# EAGLE design shcV1 (EAGLE 7.1.0)
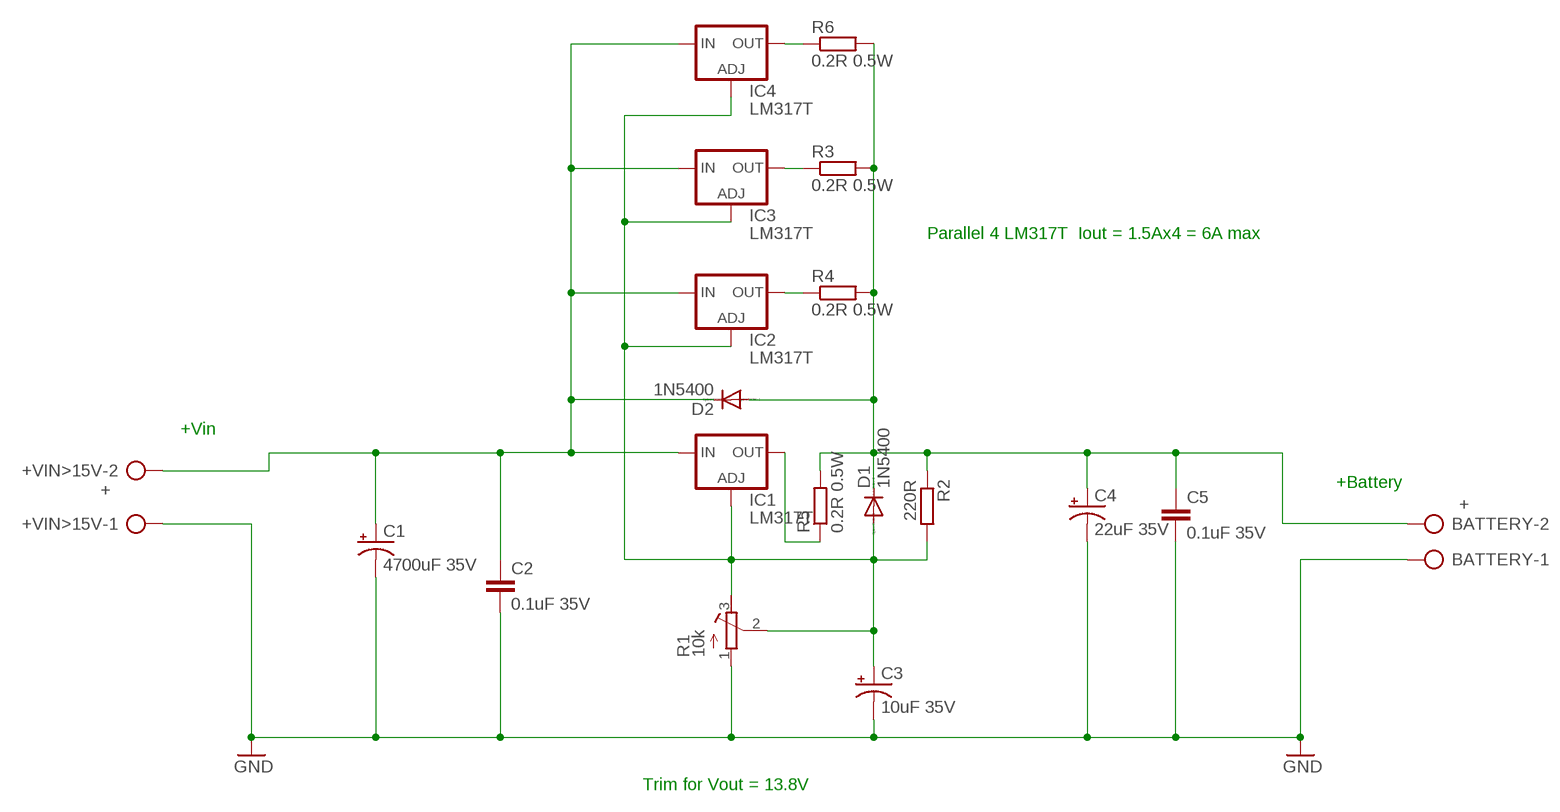
[diagram p0: schematic, sheet 1]

## Parts
+VIN>15V  +  AK300/2  [AK300/2]
BATTERY  +  AK300/2  [AK300/2]
C1  4700uF 35V  CPOL-USE5-13  [E5-13]
C2  0.1uF 35V  C-EU050-024X044  [C050-024X044]
C3  10uF 35V  CPOL-USE5-13  [E5-13]
C4  22uF 35V  CPOL-USE5-13  [E5-13]
C5  0.1uF 35V  C-EU050-024X044  [C050-024X044]
D1  1N5400  [DO201-15]
D2  1N5400  [DO201-15]
IC1  LM317T  LM317TS  [317TS]
IC2  LM317T  LM317TS  [317TS]
IC3  LM317T  LM317TS  [317TS]
IC4  LM317T  LM317TS  [317TS]
R1  10k  R-TRIMM64W  [RTRIM64W]
R2  220R  R-EU_0207/10  [0207/10]
R3  0.2R 0.5W  R-EU_0207/10  [0207/10]
R4  0.2R 0.5W  R-EU_0207/10  [0207/10]
R5  0.2R 0.5W  R-EU_0207/10  [0207/10]
R6  0.2R 0.5W  R-EU_0207/10  [0207/10]

## Nets
+BATTERY12V: BATTERY.2 C4.+ C5.1 D1.C D2.A R2.1 R3.2 R4.2 R5.2 R6.2
+FROM_MPPT: +VIN>15V.2 C1.+ C2.1 D2.C IC1.3(IN) IC2.3(IN) IC3.3(IN) IC4.3(IN)
GND: +VIN>15V.1 BATTERY.1 C1.- C2.2 C3.- C4.- C5.2 R1.1(A)
N$1: IC4.2(OUT) R6.1
N$3: C3.+ D1.A IC1.1(ADJ) IC2.1(ADJ) IC3.1(ADJ) IC4.1(ADJ) R1.2(S) R1.3(E) R2.2
N$5: IC1.2(OUT) R5.1
N$7: IC3.2(OUT) R3.1
N$8: IC2.2(OUT) R4.1

## Notes on the sheet
- Parallel 4 LM317T  Iout = 1.5Ax4 = 6A max
- +Vin
- +Battery
- Trim for Vout = 13.8V

## Library data of the parts
+VIN>15V BATTERY = con-ptr500:AK300/2: CONNECTOR; OC_FARNELL: unknown; OC_NEWARK: unknown
C1 C3 C4 = rcl:CPOL-US: POLARIZED CAPACITOR, American symbol
C2 C5 = rcl:C-EU: CAPACITOR, European symbol
D1 D2 = diode:1N5400: DIODE standard rectifier, 3 A, 50 V (Motorola)
IC1-IC4 = v-reg:LM317TS: VOLTAGE REGULATOR
R1 = rcl:R-TRIMM: Trimm resistor
R2-R6 = rcl:R-EU_: RESISTOR, European symbol

## Board
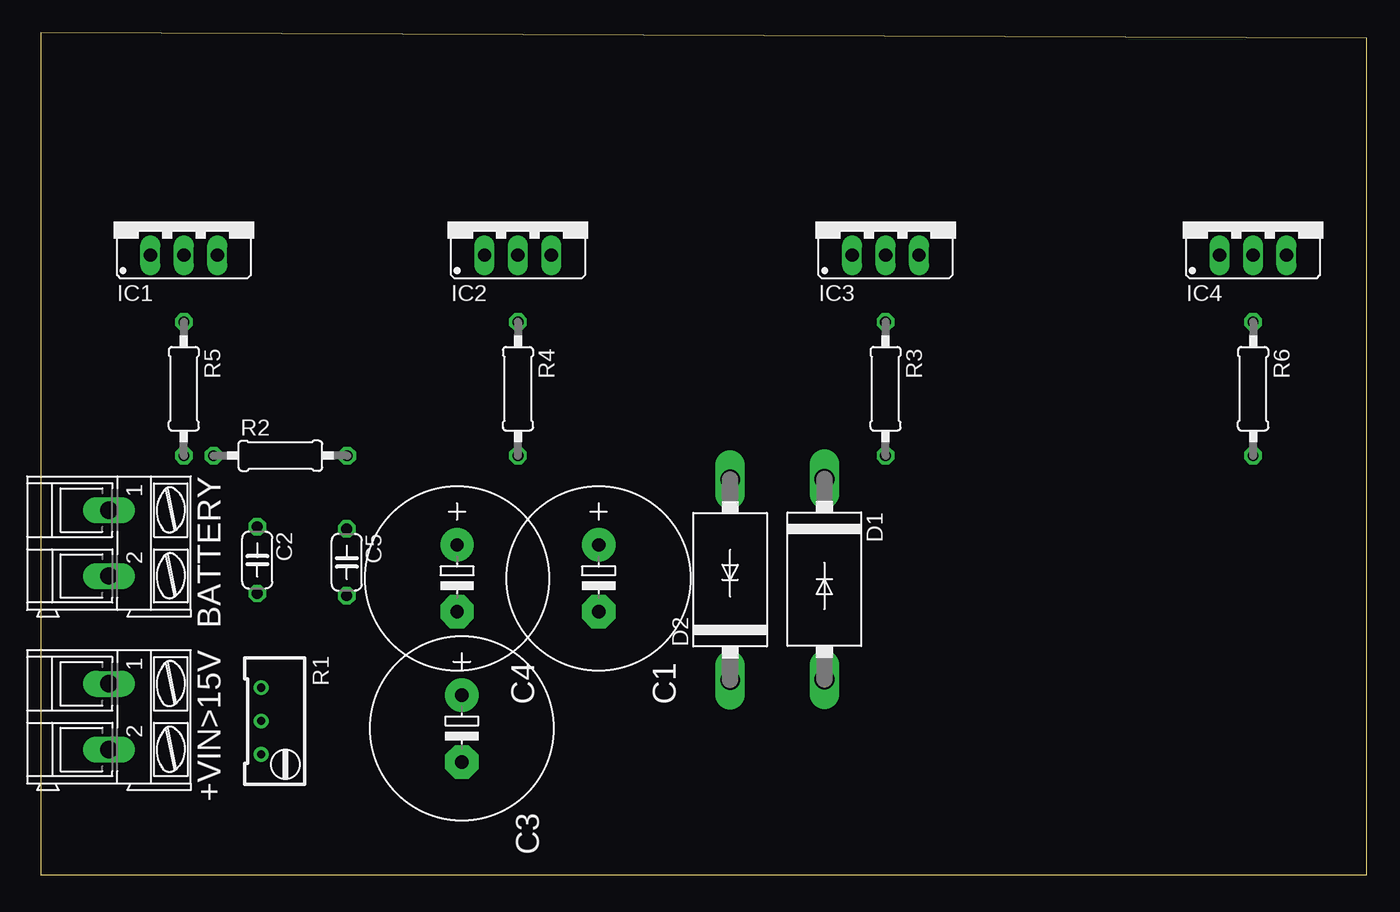
[diagram p1: board, top side]
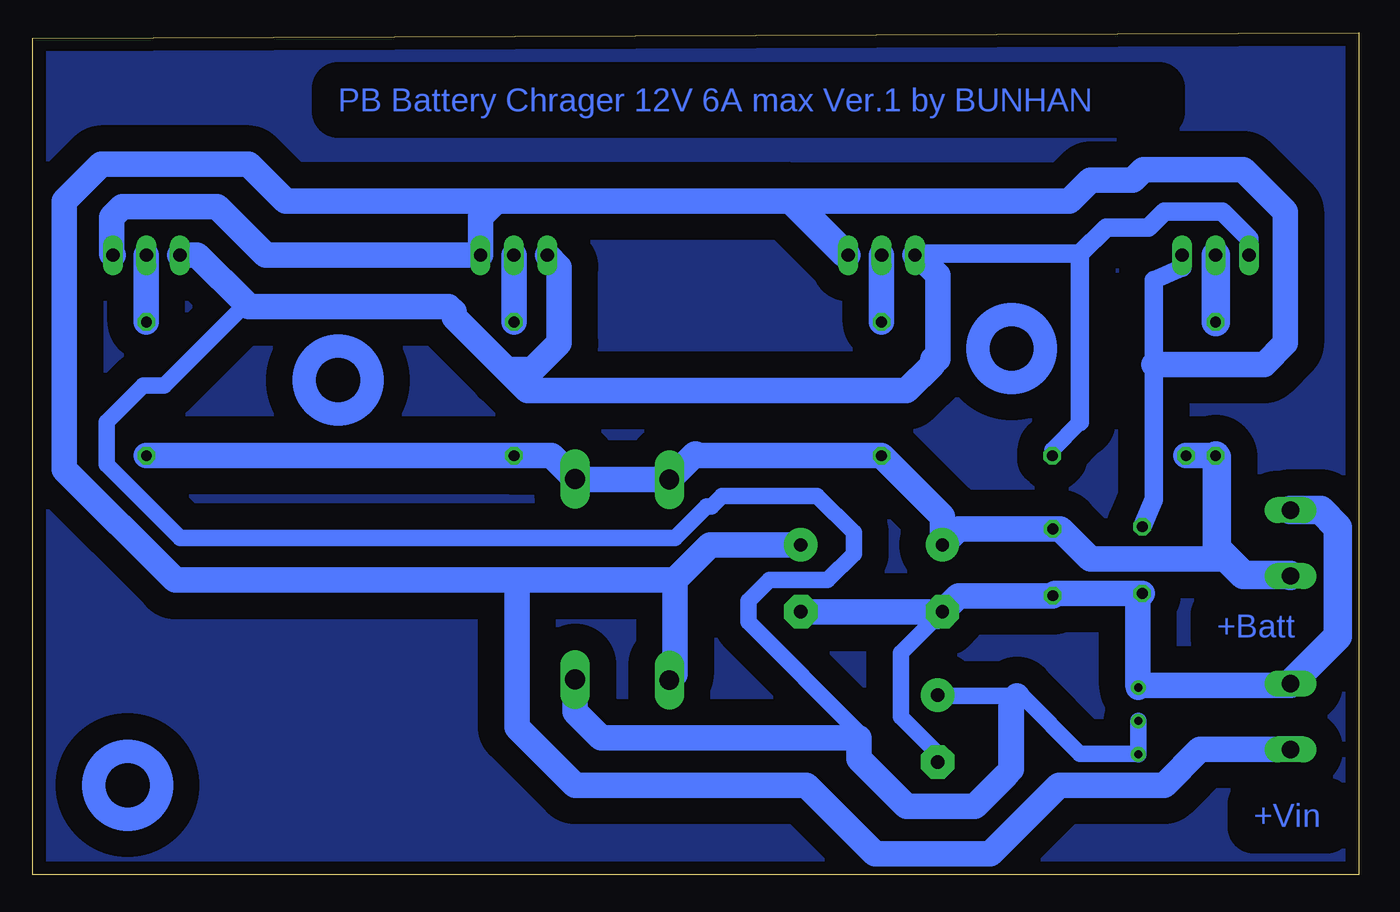
[diagram p2: board, bottom side, seen from below]

Size 100.8 x 64 mm. Coordinates in mm from the lower left corner, seen from the top.
Outline: 0,0 100.8,0 100.8,63.6 0,64 0,0
Copper layers (1*16): Top 0.035mm / dielectric 1.5mm / Bottom 0.035mm
Design rules "default *": minimum track width 10mil, minimum drill 24mil, track to track 2mm, track to pad 8mil, pad to pad 8mil, via to via 8mil, smd to smd 8mil, copper to edge 40mil, drill to drill 8mil, minimum pad ring 10mil, minimum via ring 8mil, stop-mask expansion 4mil, vias tented up to drill 0mil, thermal gap 10mil

### Footprints (pad centres in the part's own frame; a part is rotated, then mirrored left to right if it is on the bottom)
AK300/2 = drill 1.321 long: 1 -2.515,0; 2 2.489,0
E5-13 = drill 1.016 pad 2.54: + -2.54,0 | drill 1.016 pad 2.54 octagon: - 2.54,0
C050-024X044 = drill 0.813 octagon: 1 -2.54,0; 2 2.54,0
DO201-15 = drill 1.499 long: A 7.62,0; C -7.62,0
317TS = drill 1.016 long: 1 -2.54,-2.54; 2 0,-2.54; 3 2.54,-2.54
RTRIM64W = drill 0.61: 1 1.27,-2.54; 2 1.27,0; 3 1.27,2.54
0207/10 = drill 0.813 octagon: 1 -5.08,0; 2 5.08,0

### Placement (x,y rotation side)
+VIN>15V  5.2,12 270 top
BATTERY  5.2,25.2 270 top
C1  42.42,22.53 270 top
C2  16.47,23.92 270 top
C3  32.02,11.11 270 top
C4  31.66,22.53 270 top
C5  23.27,23.75 270 top
D1  59.58,22.46 270 top
D2  52.42,22.42 90 top
IC1  10.89,49.64 0 top
IC2  36.29,49.64 0 top
IC3  64.23,49.64 0 top
IC4  92.17,49.64 0 top
R1  18.03,11.68 180 top
R2  18.23,31.85 0 top
R3  64.23,36.94 270 top
R4  36.29,36.94 270 top
R5  10.89,36.94 270 top
R6  92.17,36.94 270 top

### Tracks (layer width: path | path; a pad name or v marks a point on that pad's centre or on a via)
+BATTERY12V
  Bottom 1.93: 10.2,24.2 10.4,24 20.4,24 22.69,26.29 C5.1 30.44,26.29 C4.+ 31.66,27.23 R4.2 50.26,31.86 50.4,32 50.46,32 D2.A 59.54,30.04 D1.C 61.36,31.86 R3.2 R6.2 | R5.2 R2.1
  Bottom 2.184: BATTERY.2 5.2,22.8 8.8,22.8 10.2,24.2 10.8,24.8 10.8,31.77 R5.2
+FROM_MPPT
  Bottom 1.422: IC1.3 13.43,46.17 15.6,45.2 15.6,38.8 15.6,28.53 C2.1
  Bottom 1.93: C1.+ 49.33,25.07 52,22.4 | 52,22.4 52,15.22 D2.C | IC4.3 94.8,47.19 94.8,50 94,50.8 86.8,50.8 83.1,47.1 IC3.3 66.77,50.03 65.6,51.2 | 43.2,51.2 42.93,51.2 | 42.93,51.2 IC2.3 39.1,47.1 43.2,51.2 | 42.93,51.2 22,51.2 20.4,52.8 17.2,52.8 16.4,53.6 8.8,53.6 5.6,50.4 5.6,40.4 7.2,38.8 15.6,38.8 | 43.2,51.2 65.6,51.2 | 65.6,51.2 81.6,51.2 84.4,54 95.6,54 98.4,51.2 98.4,30.8 90,22.4 64,22.4 | 64,22.4 52,22.4 | +VIN>15V.2 12.09,9.51 14.8,6.8 22.8,6.8 28,1.6 36.8,1.6 42,6.8 59.6,6.8 64,11.2 64,22.4
GND
  Bottom 1.27: R1.1 16.76,14.36 16.8,14.4 | 5.31,14.4 +VIN>15V.1 | C3.- 32.02,8.42 32,8.4 32,9.2 34.8,12 34.8,16.85 32.02,19.62 C4.-
  Bottom 1.93: C1.- 32.39,19.99 32.02,19.62 | 5.31,14.4 16.58,14.4 R1.1 | 16.8,14.4 16.8,21.05 C2.2 23.1,21.38 C5.2 30.44,21.21 C4.-
  Bottom 2.184: BATTERY.1 2.92,27.72 1.6,26.4 1.6,18.12 +VIN>15V.1
N$1
  Bottom 1.93: R6.1 IC4.2
N$2
  pour Bottom: 0,64 100.8,64 100.8,-0.4 0,-0.4
N$3
  Bottom 1.27: R1.2 R1.3 16.82,9.2 21.2,9.2 25.6,13.6 26,13.6 | C3.+ 32.02,13.62 32,13.6 26,13.6 | R2.2 23.31,32.29 21.2,34.4 | 26,13.6 26.8,12.8 26.8,7.6 | 38,8.8 38,10.8 46.4,19.2 46.4,20.8 44.8,22.4 40.4,22.4 38.4,24.4 38.4,26 41.2,28.8 48.4,28.8 49.2,28 49.6,28 52,25.6 89.6,25.6 95.2,31.2 95.2,34.4 92.4,37.2 90.8,37.2 84.6,43.4
  Bottom 1.422: IC1.1 8.35,48.35 10.4,50.4 14.8,50.4 16,49.2 19.2,49.2 21.2,47.2 | 21.2,34.4 21.2,47.2 | 21.2,47.2 33.65,47.2 IC2.1
  Bottom 1.93: D1.A 59.58,12.38 57.6,10.4 38,10.4 38,8.8 34.4,5.2 29.2,5.2 26.8,7.6 26.4,8 26.4,13.2 26,13.6 | IC4.1 88.3,47.1 84.6,43.4 84.4,43.2 69.2,43.2 68.8,42.8 68.8,42.4 64.8,38.4 | 64.8,38.4 62.8,38.4 60.8,40.4 60.8,46.21 IC3.1 | IC2.1 33.5,47.1 32,45.6 32,39.2 32.4,39.2 32.4,38.8 34.4,36.8 63.2,36.8 64.8,38.4
N$5
  Bottom 2.184: R5.1 IC1.2
N$7
  Bottom 1.93: R3.1 IC3.2
N$8
  Bottom 1.93: R4.1 IC2.2
(copper drawn outside any net)
  shapes: Bottom circle x3

### Text on the board
Bottom: PB Battery Chrager 12V 6A max Ver.1 by BUNHAN | +Batt | +Vin